# Altium schematic sheet Switch.SchDoc
size A3
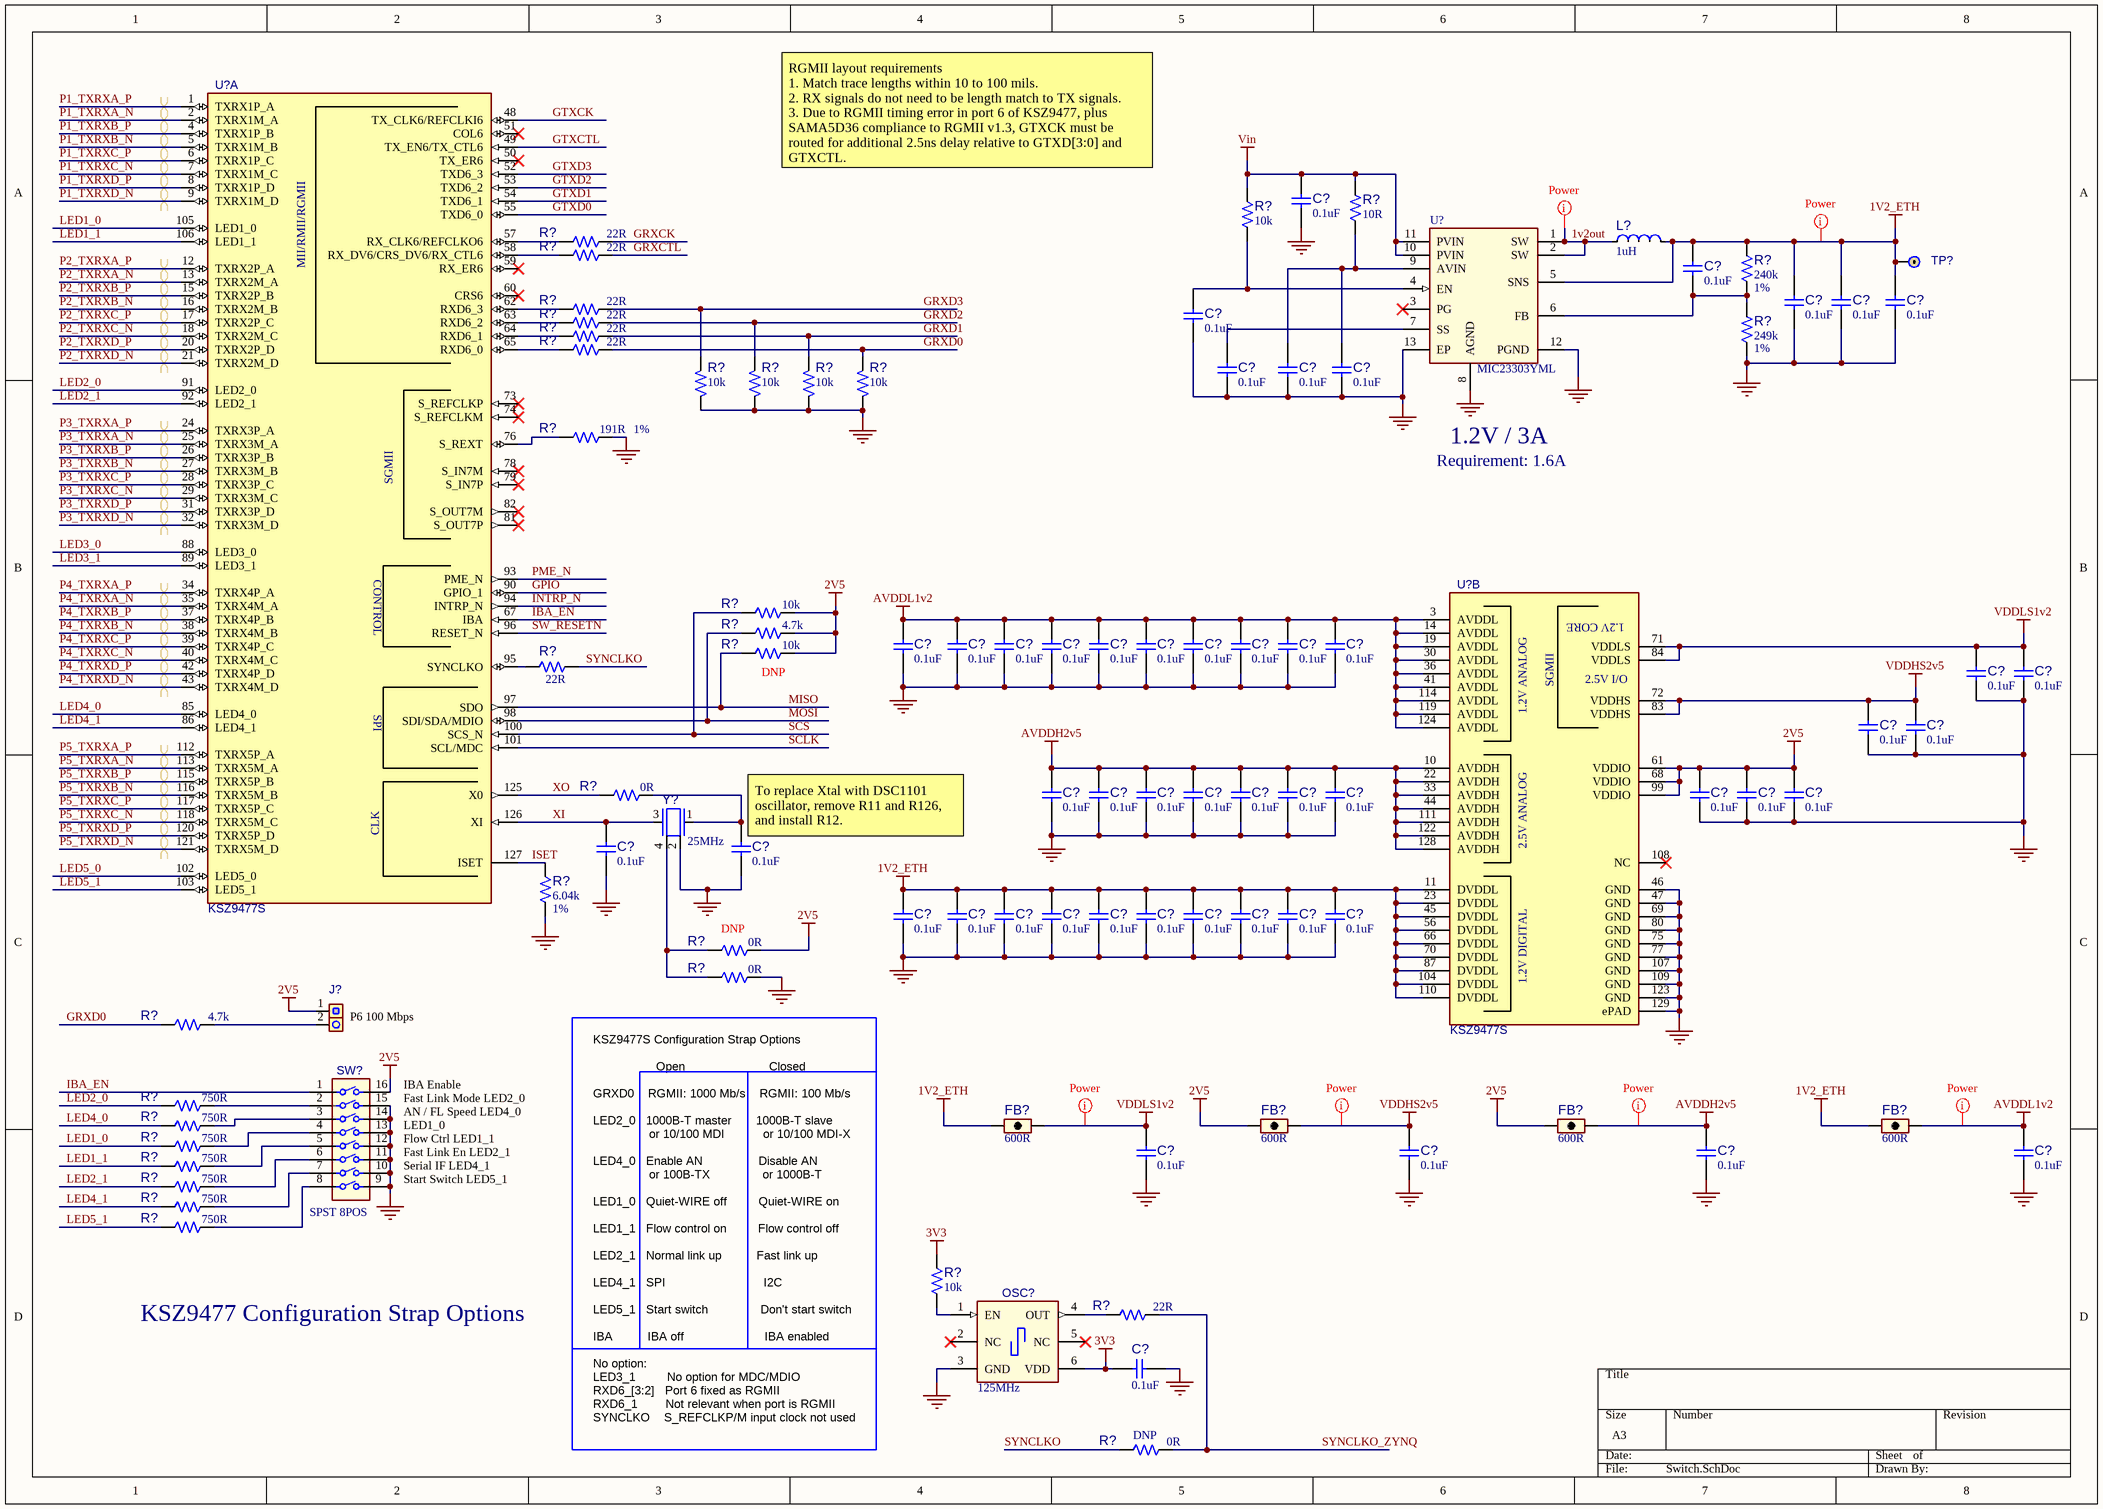
[diagram p0: Switch.SchDoc]

## Parts
(Parts that share a designator on the sheet are numbered #1, #2 ... from top to bottom, then left to right.)
C?#1  value 0.1uF  [CAP_C_0402]  (hidden comment: Capacitor NP)
C?#2  value 0.1uF  [CAP_C_0402]  (hidden comment: Capacitor NP)
C?#3  value 0.1uF  [CAP_C_0402]  (hidden comment: Capacitor NP)
C?#4  value 0.1uF  [CAP_C_0402]  (hidden comment: Capacitor NP)
C?#5  value 0.1uF  [CAP_C_0402]  (hidden comment: Capacitor NP)
C?#6  value 0.1uF  [CAP_C_0402]  (hidden comment: Capacitor NP)
C?#7  value 0.1uF  [CAP_C_0402]  (hidden comment: Capacitor NP)
C?#8  value 0.1uF  [CAP_C_0402]  (hidden comment: Capacitor NP)
C?#9  value 0.1uF  [CAP_C_0402]  (hidden comment: Capacitor NP)
C?#10  value 0.1uF  [CAP_C_0402]  (hidden comment: Capacitor NP)
C?#11  value 0.1uF  [CAP_C_0402]  (hidden comment: Capacitor NP)
C?#12  value 0.1uF  [CAP_C_0402]  (hidden comment: Capacitor NP)
C?#13  value 0.1uF  [CAP_C_0402]  (hidden comment: Capacitor NP)
C?#14  value 0.1uF  [CAP_C_0402]  (hidden comment: Capacitor NP)
C?#15  value 0.1uF  [CAP_C_0402]  (hidden comment: Capacitor NP)
C?#16  value 0.1uF  [CAP_C_0402]  (hidden comment: Capacitor NP)
C?#17  value 0.1uF  [CAP_C_0402]  (hidden comment: Capacitor NP)
C?#18  value 0.1uF  [CAP_C_0402]  (hidden comment: Capacitor NP)
C?#19  value 0.1uF  [CAP_C_0402]  (hidden comment: Capacitor NP)
C?#20  value 0.1uF  [CAP_C_0402]  (hidden comment: Capacitor NP)
C?#21  value 0.1uF  [CAP_C_0402]  (hidden comment: Capacitor NP)
C?#22  value 0.1uF  [CAP_C_0402]  (hidden comment: Capacitor NP)
C?#23  value 0.1uF  [CAP_C_0402]  (hidden comment: Capacitor NP)
C?#24  value 0.1uF  [CAP_C_0402]  (hidden comment: Capacitor NP)
C?#25  value 0.1uF  [CAP_C_0402]  (hidden comment: Capacitor NP)
C?#26  value 0.1uF  [CAP_C_0402]  (hidden comment: Capacitor NP)
C?#27  value 0.1uF  [CAP_C_0402]  (hidden comment: Capacitor NP)
C?#28  value 0.1uF  [CAP_C_0402]  (hidden comment: Capacitor NP)
C?#29  value 0.1uF  [CAP_C_0402]  (hidden comment: Capacitor NP)
C?#30  value 0.1uF  [CAP_C_0402]  (hidden comment: Capacitor NP)
C?#31  value 0.1uF  [CAP_C_0402]  (hidden comment: Capacitor NP)
C?#32  value 0.1uF  [CAP_C_0402]  (hidden comment: Capacitor NP)
C?#33  value 0.1uF  [CAP_C_0402]  (hidden comment: Capacitor NP)
C?#34  value 0.1uF  [CAP_C_0402]  (hidden comment: Capacitor NP)
C?#35  value 0.1uF  [CAP_C_0402]  (hidden comment: Capacitor NP)
C?#36  value 0.1uF  [CAP_C_0402]  (hidden comment: Capacitor NP)
C?#37  value 0.1uF  [CAP_C_0402]  (hidden comment: Capacitor NP)
C?#38  value 0.1uF  [CAP_C_0402]  (hidden comment: Capacitor NP)
C?#39  value 0.1uF  [CAP_C_0402]  (hidden comment: Capacitor NP)
C?#40  value 0.1uF  [CAP_C_0402]  (hidden comment: Capacitor NP)
C?#41  value 0.1uF  [CAP_C_0402]  (hidden comment: Capacitor NP)
C?#42  value 0.1uF  [CAP_C_0402]  (hidden comment: Capacitor NP)
C?#43  value 0.1uF  [CAP_C_0402]  (hidden comment: Capacitor NP)
C?#44  value 0.1uF  [CAP_C_0402]  (hidden comment: Capacitor NP)
C?#45  value 0.1uF  [CAP_C_0402]  (hidden comment: Capacitor NP)
C?#46  value 0.1uF  [CAP_C_0402]  (hidden comment: Capacitor NP)
C?#47  value 0.1uF  [CAP_C_0402]  (hidden comment: Capacitor NP)
C?#48  value 0.1uF  [CAP_C_0402]  (hidden comment: Capacitor NP)
C?#49  value 0.1uF  [CAP_C_0402]  (hidden comment: Capacitor NP)
C?#50  value 0.1uF  [CAP_C_0402]  (hidden comment: Capacitor NP)
FB?#1  value 600R  [IND_C_0805]  (hidden comment: Ferrite Bead)
FB?#2  value 600R  [IND_C_0805]  (hidden comment: Ferrite Bead)
FB?#3  value 600R  [IND_C_0805]  (hidden comment: Ferrite Bead)
FB?#4  value 600R  [IND_C_0805]  (hidden comment: Ferrite Bead)
J?  HDR-2.54 Male 1x2  [HDR_M_2.54_1x2]  (value not drawn)
L?  value 1uH  [IND_TAI_NR_L3W3H1.5]  (hidden comment: Inductor)
OSC?  Frequency: 125MHz  [OSC_5MX3M2_A]
R?#1  value 10R  [RES_C_0603]  (hidden comment: Resistor)
R?#2  value 22R  [RES_C_0603]  (hidden comment: Resistor)
R?#3  value 10k  [RES_C_0603]  (hidden comment: Resistor)
R?#4  value 22R  [RES_C_0603]  (hidden comment: Resistor)
R?#5  value 240k  Tolerance: 1%  [RES_C_0603]  (hidden comment: Resistor)
R?#6  value 22R  [RES_C_0603]  (hidden comment: Resistor)
R?#7  value 22R  [RES_C_0603]  (hidden comment: Resistor)
R?#8  value 22R  [RES_C_0603]  (hidden comment: Resistor)
R?#9  value 22R  [RES_C_0603]  (hidden comment: Resistor)
R?#10  value 10k  [RES_C_0603]  (hidden comment: Resistor)
R?#11  value 10k  [RES_C_0603]  (hidden comment: Resistor)
R?#12  value 10k  [RES_C_0603]  (hidden comment: Resistor)
R?#13  value 10k  [RES_C_0603]  (hidden comment: Resistor)
R?#14  value 249k  Tolerance: 1%  [RES_C_0603]  (hidden comment: Resistor)
R?#15  value 191R  Tolerance: 1%  [RES_C_0603]  (hidden comment: Resistor)
R?#16  value 10k  [RES_C_0603]  (hidden comment: Resistor)
R?#17  value 4.7k  [RES_C_0603]  (hidden comment: Resistor)
R?#18  value 10k  Populated: DNP  [RES_C_0603]  (hidden comment: Resistor)
R?#19  value 22R  [RES_C_0603]  (hidden comment: Resistor)
R?#20  value 0R  [RES_C_0603]  (hidden comment: Resistor)
R?#21  value 6.04k  Tolerance: 1%  [RES_C_0603]  (hidden comment: Resistor)
R?#22  value 0R  Populated: DNP  [RES_C_0603]  (hidden comment: Resistor)
R?#23  value 0R  [RES_C_0603]  (hidden comment: Resistor)
R?#24  value 4.7k  [RES_C_0603]  (hidden comment: Resistor)
R?#25  value 750R  [RES_C_0603]  (hidden comment: Resistor)
R?#26  value 750R  [RES_C_0603]  (hidden comment: Resistor)
R?#27  value 750R  [RES_C_0603]  (hidden comment: Resistor)
R?#28  value 750R  [RES_C_0603]  (hidden comment: Resistor)
R?#29  value 750R  [RES_C_0603]  (hidden comment: Resistor)
R?#30  value 750R  [RES_C_0603]  (hidden comment: Resistor)
R?#31  value 750R  [RES_C_0603]  (hidden comment: Resistor)
R?#32  value 10k  [RES_C_0603]  (hidden comment: Resistor)
R?#33  value 22R  [RES_C_0603]  (hidden comment: Resistor)
R?#34  value 0R  Populated: DNP  [RES_C_0603]  (hidden comment: Resistor)
SW?  SPST 8POS  [SW_SM_8POS24V_TE]
TP?  Jumper  [TP_PAD51D36]  (value not drawn)  (no BOM)
U?#1  KSZ9477S  [TQFP-128_14x14_EP10x10]  (part A of 2)
U?#2  MIC23303YML  [DFN-12_3x3]
U?#3  KSZ9477S  [TQFP-128_14x14_EP10x10]  (part B of 2)
Y?  Frequency: 25MHz  [XTAL_4PIN_3M2X2M5]  (hidden comment: XTAL 25MHz 4 pins 3225)

## Nets
1V2_ETH: C?#3.2 C?#4.2 C?#5.2 C?#6.2 C?#36.2 C?#37.2 C?#38.2 C?#39.2 C?#40.2 C?#41.2 C?#42.2 C?#43.2 C?#44.2 C?#45.2 FB?#1.1 FB?#4.1 L?.2(F) R?#5.2 TP?.1(P1) U?#2.5(SNS) U?#3.11(DVDDL) U?#3.23(DVDDL) U?#3.45(DVDDL) U?#3.56(DVDDL) U?#3.66(DVDDL) U?#3.70(DVDDL) U?#3.87(DVDDL) U?#3.104(DVDDL) U?#3.110(DVDDL)
2V5: C?#31.2 C?#32.2 C?#33.2 FB?#2.1 FB?#3.1 J?.1(P1) R?#16.1 R?#17.1 R?#18.1 R?#22.2 SW?.16 U?#3.61(VDDIO) U?#3.68(VDDIO) U?#3.99(VDDIO)
3V3: C?#50.2 OSC?.6(VDD) R?#32.2
AVDDH2v5: C?#24.2 C?#25.2 C?#26.2 C?#27.2 C?#28.2 C?#29.2 C?#30.2 C?#48.2 FB?#3.2 U?#3.10(AVDDH) U?#3.22(AVDDH) U?#3.33(AVDDH) U?#3.44(AVDDH) U?#3.111(AVDDH) U?#3.122(AVDDH) U?#3.128(AVDDH)
AVDDL1v2: C?#10.2 C?#11.2 C?#12.2 C?#13.2 C?#14.2 C?#15.2 C?#16.2 C?#17.2 C?#18.2 C?#19.2 C?#49.2 FB?#4.2 U?#3.3(AVDDL) U?#3.14(AVDDL) U?#3.19(AVDDL) U?#3.30(AVDDL) U?#3.36(AVDDL) U?#3.41(AVDDL) U?#3.114(AVDDL) U?#3.119(AVDDL) U?#3.124(AVDDL)
GND: C?#1.1 C?#2.2 C?#4.1 C?#5.1 C?#6.1 C?#7.2 C?#8.1 C?#9.1 C?#10.1 C?#11.1 C?#12.1 C?#13.1 C?#14.1 C?#15.1 C?#16.1 C?#17.1 C?#18.1 C?#19.1 C?#20.1 C?#21.1 C?#22.1 C?#23.1 C?#24.1 C?#25.1 C?#26.1 C?#27.1 C?#28.1 C?#29.1 C?#30.1 C?#31.1 C?#32.1 C?#33.1 C?#34.1 C?#35.1 C?#36.1 C?#37.1 C?#38.1 C?#39.1 C?#40.1 C?#41.1 C?#42.1 C?#43.1 C?#44.1 C?#45.1 C?#46.1 C?#47.1 C?#48.1 C?#49.1 C?#50.1 OSC?.3(GND) R?#10.2 R?#11.2 R?#12.2 R?#13.2 R?#14.1 R?#15.2 R?#21.1 R?#23.2 SW?.9 SW?.10 SW?.11 SW?.12 SW?.13 SW?.14 SW?.15 U?#2.8(AGND) U?#2.12(PGND) U?#2.13(EP) U?#3.46(GND) U?#3.47(GND) U?#3.69(GND) U?#3.75(GND) U?#3.77(GND) U?#3.80(GND) U?#3.107(GND) U?#3.109(GND) U?#3.123(GND) U?#3.129(ePAD) Y?.2(GND)
VDDHS2v5: C?#22.2 C?#23.2 C?#47.2 FB?#2.2 U?#3.72(VDDHS) U?#3.83(VDDHS)
VDDLS1v2: C?#20.2 C?#21.2 C?#46.2 FB?#1.2 U?#3.71(VDDLS) U?#3.84(VDDLS)
Vin: C?#1.2 R?#1.2 R?#3.2 U?#2.10(PVIN) U?#2.11(PVIN)
1v2out: L?.1(S) U?#2.1(SW) U?#2.2(SW)
GPIO: U?#1.90(GPIO_1)
GRXCK: R?#2.2
GRXCTL: R?#4.2
GRXD0: R?#9.2 R?#13.1 R?#24.1
GRXD1: R?#8.2 R?#12.1
GRXD2: R?#7.2 R?#11.1
GRXD3: R?#6.2 R?#10.1
GTXCK: U?#1.48(TX_CLK6/REFCLKI6)
GTXCTL: U?#1.49(TX_EN6/TX_CTL6)
GTXD0: U?#1.55(TXD6_0)
GTXD1: U?#1.54(TXD6_1)
GTXD2: U?#1.53(TXD6_2)
GTXD3: U?#1.52(TXD6_3)
IBA_EN: SW?.1 U?#1.67(IBA)
INTRP_N: U?#1.94(INTRP_N)
ISET: R?#21.2 U?#1.127(ISET)
LED1_0: R?#27.1 U?#1.105(LED1_0)
LED1_1: R?#28.1 U?#1.106(LED1_1)
LED2_0: R?#25.1 U?#1.91(LED2_0)
LED2_1: R?#29.1 U?#1.92(LED2_1)
LED3_0: U?#1.88(LED3_0)
LED3_1: U?#1.89(LED3_1)
LED4_0: R?#26.1 U?#1.85(LED4_0)
LED4_1: R?#30.1 U?#1.86(LED4_1)
LED5_0: U?#1.102(LED5_0)
LED5_1: R?#31.1 U?#1.103(LED5_1)
MISO: R?#18.2 U?#1.97(SDO)
MOSI: R?#17.2 U?#1.98(SDI/SDA/MDIO)
P1_TXRXA_N: U?#1.2(TXRX1M_A)
P1_TXRXA_P: U?#1.1(TXRX1P_A)
P1_TXRXB_N: U?#1.5(TXRX1M_B)
P1_TXRXB_P: U?#1.4(TXRX1P_B)
P1_TXRXC_N: U?#1.7(TXRX1M_C)
P1_TXRXC_P: U?#1.6(TXRX1P_C)
P1_TXRXD_N: U?#1.9(TXRX1M_D)
P1_TXRXD_P: U?#1.8(TXRX1P_D)
P2_TXRXA_N: U?#1.13(TXRX2M_A)
P2_TXRXA_P: U?#1.12(TXRX2P_A)
P2_TXRXB_N: U?#1.16(TXRX2M_B)
P2_TXRXB_P: U?#1.15(TXRX2P_B)
P2_TXRXC_N: U?#1.18(TXRX2M_C)
P2_TXRXC_P: U?#1.17(TXRX2P_C)
P2_TXRXD_N: U?#1.21(TXRX2M_D)
P2_TXRXD_P: U?#1.20(TXRX2P_D)
P3_TXRXA_N: U?#1.25(TXRX3M_A)
P3_TXRXA_P: U?#1.24(TXRX3P_A)
P3_TXRXB_N: U?#1.27(TXRX3M_B)
P3_TXRXB_P: U?#1.26(TXRX3P_B)
P3_TXRXC_N: U?#1.29(TXRX3M_C)
P3_TXRXC_P: U?#1.28(TXRX3P_C)
P3_TXRXD_N: U?#1.32(TXRX3M_D)
P3_TXRXD_P: U?#1.31(TXRX3P_D)
P4_TXRXA_N: U?#1.35(TXRX4M_A)
P4_TXRXA_P: U?#1.34(TXRX4P_A)
P4_TXRXB_N: U?#1.38(TXRX4M_B)
P4_TXRXB_P: U?#1.37(TXRX4P_B)
P4_TXRXC_N: U?#1.40(TXRX4M_C)
P4_TXRXC_P: U?#1.39(TXRX4P_C)
P4_TXRXD_N: U?#1.43(TXRX4M_D)
P4_TXRXD_P: U?#1.42(TXRX4P_D)
P5_TXRXA_N: U?#1.113(TXRX5M_A)
P5_TXRXA_P: U?#1.112(TXRX5P_A)
P5_TXRXB_N: U?#1.116(TXRX5M_B)
P5_TXRXB_P: U?#1.115(TXRX5P_B)
P5_TXRXC_N: U?#1.118(TXRX5M_C)
P5_TXRXC_P: U?#1.117(TXRX5P_C)
P5_TXRXD_N: U?#1.121(TXRX5M_D)
P5_TXRXD_P: U?#1.120(TXRX5P_D)
PME_N: U?#1.93(PME_N)
SCLK: U?#1.101(SCL/MDC)
SCS: R?#16.2 U?#1.100(SCS_N)
SW_RESETN: U?#1.96(RESET_N)
SYNCLKO: R?#19.2 R?#34.1
SYNCLKO_ZYNQ: R?#33.2 R?#34.2
XI: C?#34.2 U?#1.126(XI) Y?.3(Osc2)
XO: R?#20.1 U?#1.125(X0)
NetC?#2_1: C?#2.1 R?#3.1 U?#2.4(EN)
NetC?#3_1: C?#3.1 R?#5.1 R?#14.2 U?#2.6(FB)
NetC?#7_1: C?#7.1 C?#9.2 R?#1.1 U?#2.9(AVIN)
NetC?#8_2: C?#8.2 U?#2.7(SS)
NetC?#35_2: C?#35.2 R?#20.2 Y?.1(Osc1)
NetJ?_2: J?.2(P2) R?#24.2
NetOSC?_1: OSC?.1(EN) R?#32.1
NetOSC?_4: OSC?.4(OUT) R?#33.1
NetR?#2_1: R?#2.1 U?#1.57(RX_CLK6/REFCLKO6)
NetR?#4_1: R?#4.1 U?#1.58(RX_DV6/CRS_DV6/RX_CTL6)
NetR?#6_1: R?#6.1 U?#1.62(RXD6_3)
NetR?#7_1: R?#7.1 U?#1.63(RXD6_2)
NetR?#8_1: R?#8.1 U?#1.64(RXD6_1)
NetR?#9_1: R?#9.1 U?#1.65(RXD6_0)
NetR?#15_1: R?#15.1 U?#1.76(S_REXT)
NetR?#19_1: R?#19.1 U?#1.95(SYNCLKO)
NetR?#22_1: R?#22.1 R?#23.1 Y?.4(GND)
NetR?#25_2: R?#25.2 SW?.2
NetR?#26_2: R?#26.2 SW?.3
NetR?#27_2: R?#27.2 SW?.4
NetR?#28_2: R?#28.2 SW?.5
NetR?#29_2: R?#29.2 SW?.6
NetR?#30_2: R?#30.2 SW?.7
NetR?#31_2: R?#31.2 SW?.8

Not connected (* = marked no-connect by the designer): OSC? 2(NC)* 5(NC)*; U?#1 50(TX_ER6)* 51(COL6)* 59(RX_ER6)* 60(CRS6)* 73(S_REFCLKP)* 74(S_REFCLKM)* 78(S_IN7M)* 79(S_IN7P)* 81(S_OUT7P)* 82(S_OUT7M)*; U?#2 3(PG)*; U?#3 108(NC)*

## Layout directives
differential pair; net class Enet; net class Enet1.: P1_TXRXA_N, P1_TXRXA_P, P1_TXRXB_N, P1_TXRXB_P, P1_TXRXC_N, P1_TXRXC_P, P1_TXRXD_N, P1_TXRXD_P
differential pair; net class Enet; net class Enet2.: P2_TXRXA_N, P2_TXRXA_P, P2_TXRXB_N, P2_TXRXB_P, P2_TXRXC_N, P2_TXRXC_P, P2_TXRXD_N, P2_TXRXD_P
differential pair; net class Enet; net class Enet3.: P3_TXRXA_N, P3_TXRXA_P, P3_TXRXB_N, P3_TXRXB_P, P3_TXRXC_N, P3_TXRXC_P, P3_TXRXD_N, P3_TXRXD_P
differential pair; net class Enet; net class Enet4.: P4_TXRXA_N, P4_TXRXA_P, P4_TXRXB_N, P4_TXRXB_P, P4_TXRXC_N, P4_TXRXC_P, P4_TXRXD_N, P4_TXRXD_P
differential pair; net class Enet; net class Enet5.: P5_TXRXA_N, P5_TXRXA_P, P5_TXRXB_N, P5_TXRXB_P, P5_TXRXC_N, P5_TXRXC_P, P5_TXRXD_N, P5_TXRXD_P
net class Power (VBUS): 1V2_ETH, 1v2out, AVDDH2v5, AVDDL1v2, VDDHS2v5, VDDLS1v2

## Notes on the sheet
- RGMII layout requirements
  1. Match trace lengths within 10 to 100 mils.
  2. RX signals do not need to be length match to TX signals.
  3. Due to RGMII timing error in port 6 of KSZ9477, plus SAMA5D36 compliance to RGMII v1.3, GTXCK must be routed for additional 2.5ns delay relative to GTXD[3:0] and GTXCTL.
- 1.2V / 3A
- Requirement: 1.6A
- (near C?#35) To replace Xtal with DSC1101 oscillator, remove R11 and R126, and install R12.
- (near J?) P6 100 Mbps
- (near SW?) Fast Link Mode LED2_0
- (near SW?) AN / FL Speed LED4_0
- (near SW?) IBA Enable
- (near SW?) LED1_0
- (near SW?) Flow Ctrl LED1_1
- (near SW?) Fast Link En LED2_1
- (near SW?) Serial IF LED4_1
- (near SW?) Start Switch LED5_1
- KSZ9477 Configuration Strap Options
- KSZ9477S Configuration Strap Options
  Open                        Closed
  GRXD0    RGMII: 1000 Mb/s    RGMII: 100 Mb/s
  LED2_0   1000B-T master       1000B-T slave
  or 10/100 MDI           or 10/100 MDI-X
  LED4_0   Enable AN                Disable AN
  or 100B-TX               or 1000B-T
  LED1_0   Quiet-WIRE off         Quiet-WIRE on
  LED1_1   Flow control on         Flow control off
  LED2_1   Normal link up          Fast link up
  LED4_1   SPI                            I2C
  LED5_1   Start switch               Don't start switch
  IBA          IBA off                       IBA enabled
  No option:
  LED3_1         No option for MDC/MDIO
  RXD6_[3:2]   Port 6 fixed as RGMII
  RXD6_1        Not relevant when port is RGMII
  SYNCLKO    S_REFCLKP/M input clock not used
- (in symbol KSZ9477S_TQFP128, part A) MII/RMII/RGMII; SGMII; CONTROL; SPI; CLK
- (in symbol KSZ9477S_TQFP128, part B) 1.2V CORE; SGMII; 2.5V I/O; 1.2V ANALOG; 2.5V ANALOG; 1.2V DIGITAL

## Library data of the parts
C?#1 C?#2 C?#6 C?#7 C?#9-C?#33 C?#36-C?#45 C?#50 = Capacitor NP: Capacitor; Manufacturer: TDK Corporation; Manufacturer Part Number: C1005X7R1H104K050BB; MCHP-ID: CAP1463; Voltage: 50V; Description_: CAP CER 0.1uF 50V 10% X7R SMD 0402; Dev Tools Status: Design; Tolerance: 10%; Temperature Coeffcient: X7R; Type: Ceramic; Owner: Jamus Griego; Populated: YES; Package: 0402; Revision: A; Status: MCL Design; ComponentLink1URL: https://chn-vm-apps.microchip.com/mchprepo/parts/Datasheets/TDKMLCCCapRange.pdf; ComponentLink1Description: Datasheets; Operating Temperature: -55C to +125C; Category: Capacitor; Supplier 1: Digi-Key; Supplier Part Number 1: 445-5932-1-ND; Quantity Override: 1
C?#3-C?#5 C?#8 C?#34 C?#35 C?#46-C?#49 = Capacitor NP: Capacitor; Manufacturer: TDK Corporation; Manufacturer Part Number: C1005X7R1H104K050BB; MCHP-ID: CAP1463; Voltage: 50V; Description_: CAP CER 0.1uF 50V 10% X7R SMD 0402; Dev Tools Status: Design; Tolerance: 10%; Temperature Coeffcient: X7R; Type: Ceramic; Populated: YES; Owner: Jamus Griego; Package: 0402; Revision: A; Status: MCL Design; ComponentLink1URL: https://chn-vm-apps.microchip.com/mchprepo/parts/Datasheets/TDKMLCCCapRange.pdf; ComponentLink1Description: Datasheets; Operating Temperature: -55C to +125C; Category: Capacitor; Supplier 1: Digi-Key; Supplier Part Number 1: 445-5932-1-ND; Quantity Override: 1
FB?#1-FB?#4 = Ferrite Bead: Manufacturer: TDK Corporation; Manufacturer Part Number: MPZ2012S601AT000; MCHP-ID: IND1162; Description_: FERRITE 2A 600R SMD 0805; Dev Tools Status: Production; Owner: Randolph Sobrepena; Populated: YES; DCR: 100M; Test Frequency: 100MHz; Revision: 1; Symbol: Ferrite Bead; Status: MCL Design; ComponentLink1Description: Datasheet; Package: 0805; Type: Ferrite Bead; Category: Inductor; Supplier 1: Digi-Key; Supplier Part Number 1: 445-2206-1-ND; Quantity Override: 1; ComponentLink1URL: https://chn-vm-apps.microchip.com/mchprepo/parts/Datasheets/beads_commercial_power_mpz_en
J? = Header 1x2: CONN HEADER 2POS .100" SGL GOLD; Part Checked: Jennifer Hancock; Manufacturer Part Number: TSW-102-07-G-S; Manufacturer: Samtec; Description_: CON HDR-2.54 MALE 1x2 GOLD 5.84MH TH VERT; Populated: Yes; Package: Through Hole; Supplier 1: Digi-Key; Supplier Part Number 1: SAM1029-02-ND; Value: HDR-2.54 Male 1x2; Part Footprint Checked: *; Part Golden: Jennifer Hancock; Part 3D Model Checked: Jennifer Hancock; Manufacturer 2: FCI; Manufacturer Part Number 2: 68000-236HLF; Revision Date: 08/14/2015; Tolerance: *; Rating: *; Owner: *; Document Link: //depot_np_hweng_boards/altium_libraries/datasheets/Samtec/TSW_TH.pdf
L? = IND1027: Manufacturer 1: Taiyo Yuden; Manufacturer Part Number 1: NR3015T1R0N; Description_: INDUCTOR 1uH 2.1A 30% SMD L3W3H1.5; Dev Tools Status: Production; Owner: Tad Ahlvers; DCR: 0.036R; Saturation Current: 2.1A; Test Frequency: 100kHz; Populated: YES; MCHP-ID: IND1027; Revision: 1; Status: MCL Design; ComponentLink1URL: https://chn-vm-apps.microchip.com/mchprepo/parts/Datasheets/NR3015T1R0N.pdf; ComponentLink1Description: Datasheet; Operating Temperature: -25C to +120C; Package: L3W3H1.5; Type: Inductor; Category: Inductor; Supplier 1: Digi-Key; Supplier Part Number 1: 587-1647-1-ND; Quantity Override: 1
OSC? = DSC1101B12-125.0000: OSC MEMS 125.000MHZ CMOS SMD; Manufacturer: Micrel; Manufacturer Part Number: DSC1101BI2-125.0000; Populated: Yes; Supplier 1: Digi-Key; Category: Crystals and Oscillators; ComponentLink1URL: http://www.ctscorp.com/components/Datasheets/008-0256-0.pdf; ComponentLink1Description: Datasheet; Description_: OSC MEMS 125.000MHZ CMOS SMD; RoHS: RoHS Compliant; Package: 5.0mm x 3.2mm
R?#1 = RSMT1021: Manufacturer 1: Stackpole Electronics Inc; Manufacturer Part Number 1: RMCF0603FT10R0; Tolerance: 1%; Description_: RES TKF 10R 1% 1/10W SMD 0603; Dev Tools Status: Production; Voltage: 50V; Temperature Coeffcient: 100ppm/C; Current: 1A; Power: 1/10W; Owner: Aaron VanDuerm; Populated: Yes; MCHP-ID: RSMT1021; Package: 0603; Revision: 1; Status: MCL Design; ComponentLink1URL: https://chn-vm-apps.microchip.com/mchprepo/parts/Datasheets/SEI-RMCF_RMCP.pdf; ComponentLink1Description: Datasheet; Operating Temperature: -55C to +155C; Category: Resistor; Type: RES SMD; Composition: TKF; Supplier 1: Digi-Key; Supplier Part Number 1: RMCF0603FT10R0CT-ND; Quantity Override: 1
R?#2 R?#4 R?#6-R?#9 R?#19 R?#33 = RSMT0454: Manufacturer 1: Yageo; Manufacturer Part Number 1: RC0603FR-0722RL; Tolerance: 1%; Description_: RES TKF 22R 1% 1/10W SMD 0603; Dev Tools Status: Production; Voltage: 50V; Temperature Coeffcient: 100ppm/C; Power: 1/10W; Populated: YES; MCHP-ID: RSMT0454; Package: 0603; Revision: 2; Status: MCL Design; ComponentLink1URL: https://chn-vm-apps.microchip.com/mchprepo/parts/Datasheets/PYu-RC0603_51_RoHS_L_4.pdf; ComponentLink1Description: Datasheet; Operating Temperature: -55C to +155C; Category: Resistor; Type: RES SMD; Composition: TKF; Supplier 1: Digi-Key; Supplier Part Number 1: 311-22.0HRCT-ND; Quantity Override: 1
R?#3 R?#10-R?#13 R?#16 R?#32 = RSMT0139: Manufacturer 1: Panasonic; Manufacturer Part Number 1: ERJ-3EKF1002V; Tolerance: 1%; Description_: RES TKF 10k 1% 1/10W SMD 0603; Dev Tools Status: Production; Temperature Coeffcient: 100ppm/C; Power: 1/10W; Populated: Yes; MCHP-ID: RSMT0139; Package: 0603; Revision: 2; Status: MCL Design; ComponentLink1URL: https://chn-vm-apps.microchip.com/mchprepo/parts/Datasheets/nrc.pdf; ComponentLink1Description: Datasheet; Operating Temperature: -55C to +155C; Category: Resistor; Type: RES SMD; Composition: TKF; Manufacturer 2: Stackpole Electronics Inc; Manufacturer Part Number 2: RMCF0603FT10K0; Manufacturer 3: Yageo; Manufacturer Part Number 3: RC0603FR-0710KL; Manufacturer 4: Stackpole Electronics Inc; Manufacturer Part Number 4: RMCF 1/16 10K 1% R; Manufacturer 5: Xicon; Manufacturer Part Number 5: 302-10K-RC; Manufacturer 6: NIC Components; Manufacturer Part Number 6: NRC06F1002TRF; Supplier 1: Digi-Key; Supplier Part Number 1: P10.0KHCT-ND; Supplier 2: Digi-Key; Supplier Part Number 2: RMCF1/1610KFRTR-ND; Supplier 3: Digi-Key; Supplier Part Number 3: 311-10.0KHRCT-ND; Supplier 4: Digi-Key; Supplier Part Number 4: RMCF0603FT10K0TR-ND; Supplier 5: Mouser; Supplier Part Number 5: 302-10k-RC; Supplier 6: NIC Components; Supplier Part Number 6: NRC06F1002TRF; Quantity Override: 1
R?#5 = RES1562: Manufacturer 1: Panasonic Electronic Components; Manufacturer Part Number 1: ERJ-3EKF2403V; Description_: RES TKF 240k 1% 1/10W SMD 0603; Dev Tools Status: Design; Voltage: 75V; Temperature Coeffcient: 100ppm/C; Power: 1/10W; Owner: Tad Ahlvers; Populated: YES; MCHP-ID: RES1562; Package: 0603; Revision: A; Status: MCL Design; ComponentLink1URL: https://chn-vm-apps.microchip.com/mchprepo/parts/Datasheets/AOA0000CE2.pdf; ComponentLink1Description: Datasheet; Operating Temperature: -55C to +155C; Category: Resistor; Type: RES SMD; Composition: TKF; Supplier 1: Digi-Key; Supplier Part Number 1: P240KHCT-ND; Quantity Override: 1
R?#14 = RSMT0556: Manufacturer 1: Panasonic; Manufacturer Part Number 1: ERJ-3EKF2493V; Description_: RES TKF 249k 1% 1/10W SMD 0603; Dev Tools Status: Production; Voltage: 75V; Temperature Coeffcient: 100ppm/C; Power: 1/10W; Populated: Yes; MCHP-ID: RSMT0556; Package: 0603; Revision: 1; Status: MCL Design; ComponentLink1URL: https://chn-vm-apps.microchip.com/mchprepo/parts/Datasheets/AOA0000CE2.pdf; ComponentLink1Description: Datasheet; Operating Temperature: -55C to +155C; Category: Resistor; Type: RES SMD; Composition: TKF; Supplier 1: Digi-Key; Supplier Part Number 1: P249KHCT-ND; Quantity Override: 1
R?#15 = RES1665: Manufacturer 1: Yageo; Manufacturer Part Number 1: RC0603FR-07191RL; Description_: RES TKF 191R 1% 1/10W SMD 0603; Dev Tools Status: Design; Temperature Coeffcient: ±100ppm/°C; Power: 1/10W; Owner: Sam Charles; Populated: YES; MCHP-ID: RES1665; Package: 0603; Revision: A; Symbol: RESISTOR; Status: MCL Design; ComponentLink1URL: https://chn-vm-apps.microchip.com/mchprepo/parts/Datasheets/PYu-R_INT-thick_7.pdf; ComponentLink1Description: datasheet; Operating Temperature: -55°C ~ 155°C; Category: Resistor; Type: RES SMD; Composition: TKF; Supplier 1: Digi-Key; Supplier Part Number 1: 311-191HRCT-ND; Quantity Override: 1
R?#17 R?#24 = RSMT0713: Manufacturer 1: ROHM; Manufacturer Part Number 1: MCR03EZPFX4701; Tolerance: 1%; Description_: RES TKF 4.7k 1% 1/10W SMD 0603; Dev Tools Status: Production; Voltage: 50V; Temperature Coeffcient: 100ppm/C; Current: 1A; Power: 1/10W; Populated: Yes; MCHP-ID: RSMT0713; Package: 0603; Revision: 2; Status: MCL Design; ComponentLink1URL: https://chn-vm-apps.microchip.com/mchprepo/parts/Datasheets/SEI-RMCF_RMCP.pdf; ComponentLink1Description: Datasheet; Operating Temperature: -55C to +155C; Category: Resistor; Type: RES SMD; Composition: TKF; Manufacturer 2: Stackpole Electronics Inc; Manufacturer Part Number 2: RMCF0603FT4K70; Manufacturer 3: Yageo; Manufacturer Part Number 3: RC0603FR-074K7L; Supplier 1: Digi-Key; Supplier Part Number 1: RHM4.70KHCT-ND; Supplier 2: Digi-Key; Supplier Part Number 2: RMCF0603FT4K70CT-ND; Supplier 3: Digi-Key; Supplier Part Number 3: 311-4.70KHRTR-ND; Quantity Override: 1
R?#18 = RSMT0139: Manufacturer 1: Panasonic; Manufacturer Part Number 1: ERJ-3EKF1002V; Tolerance: 1%; Description_: RES TKF 10k 1% 1/10W SMD 0603; Dev Tools Status: Production; Temperature Coeffcient: 100ppm/C; Power: 1/10W; MCHP-ID: RSMT0139; Package: 0603; Revision: 2; Status: MCL Design; ComponentLink1URL: https://chn-vm-apps.microchip.com/mchprepo/parts/Datasheets/nrc.pdf; ComponentLink1Description: Datasheet; Operating Temperature: -55C to +155C; Category: Resistor; Type: RES SMD; Composition: TKF; Manufacturer 2: Stackpole Electronics Inc; Manufacturer Part Number 2: RMCF0603FT10K0; Manufacturer 3: Yageo; Manufacturer Part Number 3: RC0603FR-0710KL; Manufacturer 4: Stackpole Electronics Inc; Manufacturer Part Number 4: RMCF 1/16 10K 1% R; Manufacturer 5: Xicon; Manufacturer Part Number 5: 302-10K-RC; Manufacturer 6: NIC Components; Manufacturer Part Number 6: NRC06F1002TRF; Supplier 1: Digi-Key; Supplier Part Number 1: P10.0KHCT-ND; Supplier 2: Digi-Key; Supplier Part Number 2: RMCF1/1610KFRTR-ND; Supplier 3: Digi-Key; Supplier Part Number 3: 311-10.0KHRCT-ND; Supplier 4: Digi-Key; Supplier Part Number 4: RMCF0603FT10K0TR-ND; Supplier 5: Mouser; Supplier Part Number 5: 302-10k-RC; Supplier 6: NIC Components; Supplier Part Number 6: NRC06F1002TRF; Quantity Override: 1
R?#20 R?#23 = RSMT0001: Manufacturer 1: Panasonic; Manufacturer Part Number 1: ERJ-3GSY0R00V; Description_: RES TKF 0R 1/10W SMD 0603; Dev Tools Status: Production; Power: 1/10W; Populated: Yes; MCHP-ID: RSMT0001; Package: 0603; Revision: 2; Status: MCL Design; ComponentLink1URL: https://chn-vm-apps.microchip.com/mchprepo/parts/Datasheets/nrc.pdf; ComponentLink1Description: Datasheet; Operating Temperature: -55C to +155C; Category: Resistor; Type: RES SMD; Composition: TKF; Manufacturer 2: Panasonic; Manufacturer Part Number 2: ERJ-3GEY0R00V; Manufacturer 3: ROHM; Manufacturer Part Number 3: MCR03EZPJ000; Manufacturer 4: Stackpole Electronics Inc; Manufacturer Part Number 4: RMCF0603ZT0R00; Manufacturer 5: Stackpole Electronics Inc; Manufacturer Part Number 5: RMCF 1/16 0 R; Manufacturer 6: Vishay; Manufacturer Part Number 6: CRCW06030000Z0EA; Manufacturer 7: Yageo; Manufacturer Part Number 7: RC0603JR-070RL; Manufacturer 8: KOA Speer; Manufacturer Part Number 8: RK73Z1JTTP; Manufacturer 9: NIC Components; Manufacturer Part Number 9: NRC06Z0TRF; Supplier 1: Digi-Key; Supplier Part Number 1: P0.0GTR-ND; Supplier 2: Digi-Key; Supplier Part Number 2: RHM0.0GCT-ND; Supplier 3: Digi-Key; Supplier Part Number 3: RMCF0603ZT0R00TR-ND; Supplier 4: Digi-Key; Supplier Part Number 4: RMCF0603ZT0R00CT-ND; Supplier 5: Digi-Key; Supplier Part Number 5: RMCF1/160RTR-ND; Supplier 6: Digi-Key; Supplier Part Number 6: 541-0.0GCT-ND; Supplier 7: Digi-Key; Supplier Part Number 7: 311-0.0GRCT-ND; Supplier 8: KOA Speer; Supplier Part Number 8: RK73Z1JTTP; Supplier 9: NIC Components; Supplier Part Number 9: NRC06Z0TRF; Quantity Override: 1
R?#21 = RSMT0277: Manufacturer 1: Yageo; Manufacturer Part Number 1: 9T06031A6041FBHFT; Description_: RES TKF 6.04k 1% 1/10W SMD 0603; Dev Tools Status: Production; Voltage: 50V; Temperature Coeffcient: 100ppm/C; Power: 1/10W; Populated: Yes; MCHP-ID: RSMT0277; Package: 0603; Revision: 1; Status: MCL Design; ComponentLink1URL: https://chn-vm-apps.microchip.com/mchprepo/parts/Datasheets/SEI-RMCF_RMCP.pdf; ComponentLink1Description: Datasheet; Operating Temperature: -55C to +155C; Category: Resistor; Type: RES SMD; Composition: TKF; Manufacturer 2: Stackpole Electronics Inc; Manufacturer Part Number 2: RMCF 1/16 6.04K 1% TR; Manufacturer 3: Stackpole Electronics Inc; Manufacturer Part Number 3: RMC 1/16 6.04K 1% TR; Manufacturer 4: Yageo; Manufacturer Part Number 4: 9T06031A6041FBPFT; Supplier 1: Digi-Key; Supplier Part Number 1: 9T06031A6041FBHFT-ND; Supplier 2: Stackpole Electronics Inc; Supplier Part Number 2: RMCF 1/16 6.04K 1% TR; Supplier 3: Stackpole Electronics Inc; Supplier Part Number 3: RMC 1/16 6.04K 1% TR; Supplier 4: Yageo; Supplier Part Number 4: 9T06031A6041FBPFT; Quantity Override: 1
R?#22 R?#34 = RSMT0001: Manufacturer 1: Panasonic; Manufacturer Part Number 1: ERJ-3GSY0R00V; Description_: RES TKF 0R 1/10W SMD 0603; Dev Tools Status: Production; Power: 1/10W; MCHP-ID: RSMT0001; Package: 0603; Revision: 2; Status: MCL Design; ComponentLink1URL: https://chn-vm-apps.microchip.com/mchprepo/parts/Datasheets/nrc.pdf; ComponentLink1Description: Datasheet; Operating Temperature: -55C to +155C; Category: Resistor; Type: RES SMD; Composition: TKF; Manufacturer 2: Panasonic; Manufacturer Part Number 2: ERJ-3GEY0R00V; Manufacturer 3: ROHM; Manufacturer Part Number 3: MCR03EZPJ000; Manufacturer 4: Stackpole Electronics Inc; Manufacturer Part Number 4: RMCF0603ZT0R00; Manufacturer 5: Stackpole Electronics Inc; Manufacturer Part Number 5: RMCF 1/16 0 R; Manufacturer 6: Vishay; Manufacturer Part Number 6: CRCW06030000Z0EA; Manufacturer 7: Yageo; Manufacturer Part Number 7: RC0603JR-070RL; Manufacturer 8: KOA Speer; Manufacturer Part Number 8: RK73Z1JTTP; Manufacturer 9: NIC Components; Manufacturer Part Number 9: NRC06Z0TRF; Supplier 1: Digi-Key; Supplier Part Number 1: P0.0GTR-ND; Supplier 2: Digi-Key; Supplier Part Number 2: RHM0.0GCT-ND; Supplier 3: Digi-Key; Supplier Part Number 3: RMCF0603ZT0R00TR-ND; Supplier 4: Digi-Key; Supplier Part Number 4: RMCF0603ZT0R00CT-ND; Supplier 5: Digi-Key; Supplier Part Number 5: RMCF1/160RTR-ND; Supplier 6: Digi-Key; Supplier Part Number 6: 541-0.0GCT-ND; Supplier 7: Digi-Key; Supplier Part Number 7: 311-0.0GRCT-ND; Supplier 8: KOA Speer; Supplier Part Number 8: RK73Z1JTTP; Supplier 9: NIC Components; Supplier Part Number 9: NRC06Z0TRF; Quantity Override: 1
R?#25-R?#31 = RES1052: Manufacturer 1: Vishay; Manufacturer Part Number 1: CRCW0603750RFKEA; Tolerance: 1%; Description_: RES TKF 750R 1% 1/10W SMD 0603; Dev Tools Status: Production; Voltage: 75V; Temperature Coeffcient: 100ppm/C; Power: 1/10W; Owner: Tad Ahlvers; Populated: YES; MCHP-ID: RES1052; Package: 0603; Revision: 1; Status: MCL Design; ComponentLink1URL: https://chn-vm-apps.microchip.com/mchprepo/parts/Datasheets/dcrcwe3.pdf; ComponentLink1Description: Datasheet; Operating Temperature: -55C to +155C; Category: Resistor; Type: RES SMD; Composition: TKF; Supplier 1: Digi-Key; Supplier Part Number 1: 541-750HCT-ND; Quantity Override: 1
SW? = Switch DIP 8 Pos: Switch DIP SPST 8POS SMD; Manufacturer: TE Connectivity Alcoswitch Switches; Manufacturer Part Number: 1-1825058-9; Description_: SWITCH SLIDE SPST 24V 100mA 1825058-9EXT ACT 8POS 24V; Voltage Rating: 24VDC; Populated: Yes; Supplier 1: Mouser; Supplier 2: Digi-Key; RoHS: Yes; ComponentLink1URL: http://www.te.com/commerce/DocumentDelivery/DDEController?Action=srchrtrv&DocNm=1825058&DocType=Customer+Drawing&DocLang=English; ComponentLink1Description: http://www.te.com/commerce/DocumentDelivery/DDEController?Action=srchrtrv&DocNm=1825058&DocType=Customer+Drawing&DocLang=English; Supplier Part Number 1: 506-ADE08S04; Supplier Part Number 2: 1-1825058-9-ND; Value: SPST 8POS
TP? = TEST PAD TH 51X36: Manufacturer Part Number: none; Description_: TEST Pad, PIN sized, 51pad, 36 FHS; Populated: Yes; Manufacturer: none; Category: Non BOM Item; Type: Male; Mounting Type: Through Hole; Supplier 1: none; Supplier Part Number 1: none
U?#1 U?#3 = KSZ9477S_TQFP128: IC, 7-Port Gigabit Ethernet Switch with 2 RGMII / MII / RMII Interfaces, TQFP128; Manufacturer: Micrel; Populated: Yes; Owner: sam charles; Description_: IC, 7-Port Gigabit Ethernet Switch with 2 RGMII / MII / RMII Interfaces, TQFP128; Revision Date: 06/03/2016; RoHS: Yes; Package: TQFP128-14x14; Document Link: http://nyusperforce.smsc.com//depot_np_hweng_boards/altium_libraries/datasheets/_Microchip/_Micrel/KSZ9897R.pdf; Status: New; Value: KSZ9477S; Manufacturer Part Number: KSZ9477S
U?#2 = MIC23303YML: 4MHz PWM 3A Buck Regulator with HyperLight Load and Power Good; Part Checked: Carl Johnson; Manufacturer: Microchip Technology; Populated: Yes; Temperature Rating: -40 to +125 C; Description_: 4MHz PWM 3A Buck Regulator with HyperLight Load and Power Good; Document Link: http://nyusperforce.smsc.com//depot_np_hweng_boards/altium_libraries/datasheets/_Microchip/_Micrel/MIC23303.pdf; Owner: *; Part 3D Model Checked: *; Part Footprint Checked: *; Part Golden: *; Revision Date: 06/20/16; Package: DFN12-3x3; Supplier 1: DigiKey; Supplier 2: Mouser; Supplier Part Number 1: 1611-MIC23303YML-T5CT-ND; Supplier Part Number 2: 998-MIC23303YMLT5; Value: MIC23303YML; Manufacturer Part Number: MIC23303YML
Y? = XTAL 25MHz 4 pins 3225: Crystal 25MHz 4 pins 3225; Manufacturer: Murata Electronics North America; Manufacturer Part Number: ABM8G-25.000MHZ-B4Y-T; Frequency Stability: ±20ppm; Frequency Tolerance: ±30ppm; Load Capacitance: 6pF; Operating Mode: Fundamental; Populated: Yes; Description_: Crystal 25MHz 6pF SMD 4Pin DFN LCC; Revision: A; RoHS: RoHS Compliant; Category: Crystals and Oscillators; Packaging: Cut Tape (CT); Type: MHz Crystal; Operating Temperature: -30°C ~ 85°C; Package / Case: 4-SMD, No Lead (DFN, LCC); Size / Dimension: 3.2 mm x 2.5mm; ComponentLink1URL: http://search.murata.co.jp/Ceramy/image/img/w_hinm/; ComponentLink1Description: http://search.murata.co.jp/Ceramy/image/img/w_hinm/; Supplier 1: Mouser; Supplier Part Number 1: 815-ABM8G-25-B4Y-T